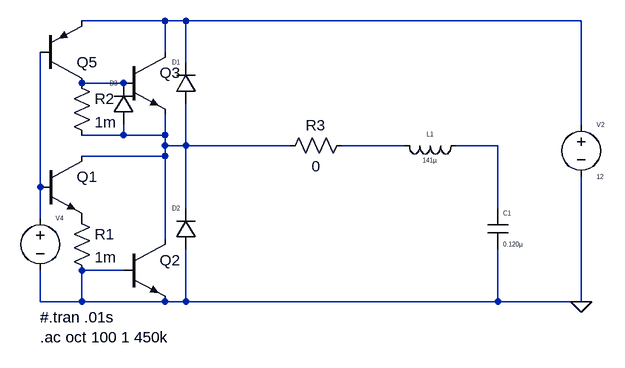
[diagram p0: schematic class_d_simulation.asc]
class_d_simulation.asc, the LTspice schematic file:
Version 4
SHEET 1 1000 776
WIRE 320 240 192 240
WIRE 352 240 320 240
WIRE 960 240 352 240
WIRE 320 288 320 240
WIRE 352 304 352 240
WIRE 256 336 192 336
WIRE 960 400 960 240
WIRE 256 416 256 400
WIRE 256 416 192 416
WIRE 320 416 320 384
WIRE 320 416 256 416
WIRE 320 432 320 416
WIRE 352 432 352 368
WIRE 352 432 320 432
WIRE 512 432 352 432
WIRE 688 432 592 432
WIRE 832 432 768 432
WIRE 320 448 320 432
WIRE 320 448 192 448
WIRE 128 496 128 288
WIRE 352 528 352 432
WIRE 832 528 832 432
WIRE 128 544 128 496
WIRE 320 576 320 448
WIRE 256 624 192 624
WIRE 128 672 128 624
WIRE 192 672 192 624
WIRE 192 672 128 672
WIRE 320 672 192 672
WIRE 352 672 352 592
WIRE 352 672 320 672
WIRE 832 672 832 592
WIRE 832 672 352 672
WIRE 960 672 960 480
WIRE 960 672 832 672
FLAG 960 672 0
SYMBOL ind 784 416 R90
WINDOW 0 5 56 VBottom 0
WINDOW 3 32 56 VTop 0
SYMATTR InstName L1
SYMATTR Value 141µ
SYMBOL cap 816 528 R0
WINDOW 0 24 8 Left 0
WINDOW 3 24 56 Left 0
SYMATTR InstName C1
SYMATTR Value 0.120µ
SYMBOL voltage 960 384 R0
WINDOW 0 24 16 Left 0
WINDOW 3 24 96 Left 0
SYMATTR InstName V2
SYMATTR Value 12
SYMBOL voltage 128 528 R0
WINDOW 0 24 16 Left 0
WINDOW 3 123 96 Invisible 0
SYMATTR InstName V4
SYMATTR Value PULSE(0 5 0 .00001 .00001 .0005 .001)
SYMATTR Value2 AC 5
SYMBOL pnp 128 336 M180
WINDOW 3 84 68 Invisible 0
SYMATTR Value 2N2907
SYMATTR InstName Q5
SYMBOL npn 128 448 R0
WINDOW 3 56 68 Invisible 0
SYMATTR Value FZT849
SYMATTR InstName Q1
SYMBOL npn 256 576 R0
WINDOW 3 56 68 Invisible 0
SYMATTR Value FZT849
SYMATTR InstName Q2
SYMBOL npn 256 288 R0
WINDOW 3 56 68 Invisible 0
SYMATTR Value 2N2222
SYMATTR InstName Q3
SYMBOL diode 368 368 R180
WINDOW 0 24 64 Left 0
WINDOW 3 24 0 Invisible 0
SYMATTR InstName D1
SYMBOL diode 368 592 R180
WINDOW 0 24 64 Left 0
WINDOW 3 24 0 Invisible 0
SYMATTR InstName D2
SYMBOL diode 272 400 R180
WINDOW 0 24 64 Left 0
WINDOW 3 24 0 Invisible 0
SYMATTR InstName D3
SYMBOL res 176 528 R0
SYMATTR InstName R1
SYMATTR Value 1m
SYMBOL res 176 320 R0
SYMATTR InstName R2
SYMATTR Value 1m
SYMBOL res 608 416 R90
WINDOW 0 0 56 VBottom 2
WINDOW 3 32 56 VTop 2
SYMATTR InstName R3
SYMATTR Value 0
TEXT 128 696 Left 2 !#.tran .01s\n.ac oct 100 1 450k

The netlist it stands for:
* class_d_simulation.asc
L1 N005 N004 141µ
C1 N005 0 0.120µ
V2 N001 0 12
V4 N006 0 PULSE(0 5 0 .00001 .00001 .0005 .001) AC 5
Q5 N002 N006 N001 0 2N2907
Q1 N003 N006 P001 0 FZT849
Q2 N003 0 0 0 FZT849
Q3 N001 N002 N003 0 2N2222
D1 N003 N001 D
D2 0 N003 D
D3 N003 N002 D
R1 P001 0 1m
R2 N002 N003 1m
R3 N004 N003 0
.model D D
.lib standard.dio
.model NPN NPN
.model PNP PNP
.lib standard.bjt
#.tran .01s
.ac oct 100 1 450k
.backanno
.end